# Altium schematic sheet QCopterCAM_MCU_Sch.SchDoc
size A4
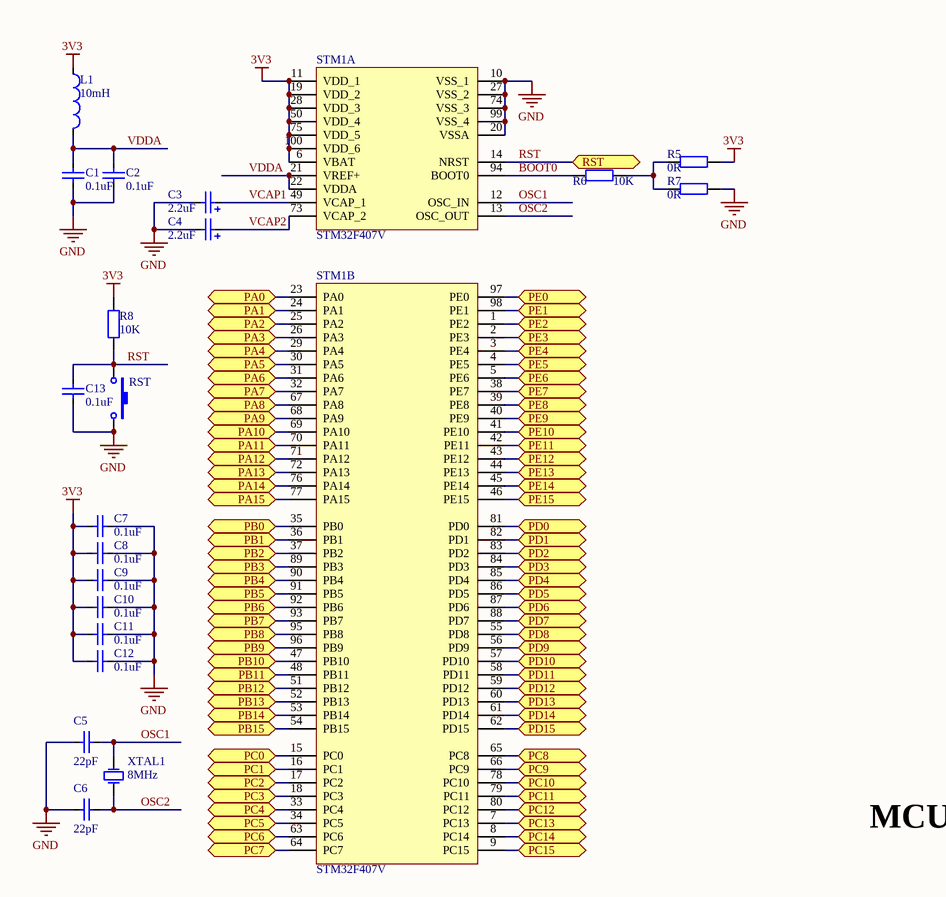
[diagram p0: QCopterCAM_MCU_Sch.SchDoc]

## Parts
C1  value 0.1uF  [CAP_0603]  (hidden comment: Cap_0603)
C2  value 0.1uF  [CAP_0603]  (hidden comment: Cap_0603)
C3  value 2.2uF  [CAP_TAN_P0805]  (hidden comment: Cap_Tan_0805)
C4  value 2.2uF  [CAP_TAN_P0805]  (hidden comment: Cap_Tan_0805)
C5  value 22pF  [CAP_0603]  (hidden comment: Cap_0603)
C6  value 22pF  [CAP_0603]  (hidden comment: Cap_0603)
C7  value 0.1uF  [CAP_0603]  (hidden comment: Cap_0603)
C8  value 0.1uF  [CAP_0603]  (hidden comment: Cap_0603)
C9  value 0.1uF  [CAP_0603]  (hidden comment: Cap_0603)
C10  value 0.1uF  [CAP_0603]  (hidden comment: Cap_0603)
C11  value 0.1uF  [CAP_0603]  (hidden comment: Cap_0603)
C12  value 0.1uF  [CAP_0603]  (hidden comment: Cap_0603)
C13  value 0.1uF  [CAP_0603]  (hidden comment: Cap_0603)
L1  value 10mH  [IND_0603]  (hidden comment: Ind_0603)
R5  value 0R  [RES_0603]  (hidden comment: Res_0603)
R6  value 10K  [RES_0603]  (hidden comment: Res_0603)
R7  value 0R  [RES_0603]  (hidden comment: Res_0603)
R8  value 10K  [RES_0603]  (hidden comment: Res_0603)
RST  SW-PB_1  [BT_90_T]  (value not drawn)
STM1  STM32F407V  [STM32F_100]  (parts A,B of 2)
XTAL1  value 8MHz  [XTAL_5032]  (hidden comment: XTAL_5032)

## Ports
PA0, PA1, PA2, PA3, PA4, PA5, PA6, PA7, PA8, PA9, PA10, PA11, PA12, PA13, PA14, PA15, PB0, PB1, PB2, PB3, PB4, PB5, PB6, PB7, PB8, PB9, PB10, PB11, PB12, PB13, PB14, PB15, PC0, PC1, PC2, PC3, PC4, PC5, PC6, PC7, PC8, PC9, PC10, PC11, PC12, PC13, PC14, PC15, PD0, PD1, PD2, PD3, PD4, PD5, PD6, PD7, PD8, PD9, PD10, PD11, PD12, PD13, PD14, PD15, PE0, PE1, PE2, PE3, PE4, PE5, PE6, PE7, PE8, PE9, PE10, PE11, PE12, PE13, PE14, PE15, RST

## Nets
3V3: C7.2 C8.2 C9.2 C10.2 C11.2 C12.2 L1.1 R5.2 R8.1 STM1.6(VBAT) STM1.11(VDD_1) STM1.19(VDD_2) STM1.28(VDD_3) STM1.50(VDD_4) STM1.75(VDD_5) STM1.100(VDD_6)
GND: C1.2 C2.2 C3.2 C4.2 C5.1 C6.1 C7.1 C8.1 C9.1 C10.1 C11.1 C12.1 C13.2 R7.2 RST.2 STM1.10(VSS_1) STM1.20(VSSA) STM1.27(VSS_2) STM1.74(VSS_3) STM1.99(VSS_4)
BOOT0: R6.1 STM1.94(BOOT0)
OSC1: C5.2 STM1.12(OSC_IN) XTAL1.2(OSC2)
OSC2: C6.2 STM1.13(OSC_OUT) XTAL1.1(OSC1)
PA0: STM1.23(PA0) ; port PA0
PA1: STM1.24(PA1) ; port PA1
PA2: STM1.25(PA2) ; port PA2
PA3: STM1.26(PA3) ; port PA3
PA4: STM1.29(PA4) ; port PA4
PA5: STM1.30(PA5) ; port PA5
PA6: STM1.31(PA6) ; port PA6
PA7: STM1.32(PA7) ; port PA7
PA8: STM1.67(PA8) ; port PA8
PA9: STM1.68(PA9) ; port PA9
PA10: STM1.69(PA10) ; port PA10
PA11: STM1.70(PA11) ; port PA11
PA12: STM1.71(PA12) ; port PA12
PA13: STM1.72(PA13) ; port PA13
PA14: STM1.76(PA14) ; port PA14
PA15: STM1.77(PA15) ; port PA15
PB0: STM1.35(PB0) ; port PB0
PB1: STM1.36(PB1) ; port PB1
PB2: STM1.37(PB2) ; port PB2
PB3: STM1.89(PB3) ; port PB3
PB4: STM1.90(PB4) ; port PB4
PB5: STM1.91(PB5) ; port PB5
PB6: STM1.92(PB6) ; port PB6
PB7: STM1.93(PB7) ; port PB7
PB8: STM1.95(PB8) ; port PB8
PB9: STM1.96(PB9) ; port PB9
PB10: STM1.47(PB10) ; port PB10
PB11: STM1.48(PB11) ; port PB11
PB12: STM1.51(PB12) ; port PB12
PB13: STM1.52(PB13) ; port PB13
PB14: STM1.53(PB14) ; port PB14
PB15: STM1.54(PB15) ; port PB15
PC0: STM1.15(PC0) ; port PC0
PC1: STM1.16(PC1) ; port PC1
PC2: STM1.17(PC2) ; port PC2
PC3: STM1.18(PC3) ; port PC3
PC4: STM1.33(PC4) ; port PC4
PC5: STM1.34(PC5) ; port PC5
PC6: STM1.63(PC6) ; port PC6
PC7: STM1.64(PC7) ; port PC7
PC8: STM1.65(PC8) ; port PC8
PC9: STM1.66(PC9) ; port PC9
PC10: STM1.78(PC10) ; port PC10
PC11: STM1.79(PC11) ; port PC11
PC12: STM1.80(PC12) ; port PC12
PC13: STM1.7(PC13) ; port PC13
PC14: STM1.8(PC14) ; port PC14
PC15: STM1.9(PC15) ; port PC15
PD0: STM1.81(PD0) ; port PD0
PD1: STM1.82(PD1) ; port PD1
PD2: STM1.83(PD2) ; port PD2
PD3: STM1.84(PD3) ; port PD3
PD4: STM1.85(PD4) ; port PD4
PD5: STM1.86(PD5) ; port PD5
PD6: STM1.87(PD6) ; port PD6
PD7: STM1.88(PD7) ; port PD7
PD8: STM1.55(PD8) ; port PD8
PD9: STM1.56(PD9) ; port PD9
PD10: STM1.57(PD10) ; port PD10
PD11: STM1.58(PD11) ; port PD11
PD12: STM1.59(PD12) ; port PD12
PD13: STM1.60(PD13) ; port PD13
PD14: STM1.61(PD14) ; port PD14
PD15: STM1.62(PD15) ; port PD15
PE0: STM1.97(PE0) ; port PE0
PE1: STM1.98(PE1) ; port PE1
PE2: STM1.1(PE2) ; port PE2
PE3: STM1.2(PE3) ; port PE3
PE4: STM1.3(PE4) ; port PE4
PE5: STM1.4(PE5) ; port PE5
PE6: STM1.5(PE6) ; port PE6
PE7: STM1.38(PE7) ; port PE7
PE8: STM1.39(PE8) ; port PE8
PE9: STM1.40(PE9) ; port PE9
PE10: STM1.41(PE10) ; port PE10
PE11: STM1.42(PE11) ; port PE11
PE12: STM1.43(PE12) ; port PE12
PE13: STM1.44(PE13) ; port PE13
PE14: STM1.45(PE14) ; port PE14
PE15: STM1.46(PE15) ; port PE15
RST: C13.1 R8.2 RST.1 STM1.14(NRST) ; port RST
VCAP1: C3.1 STM1.49(VCAP_1)
VCAP2: C4.1 STM1.73(VCAP_2)
VDDA: C1.1 C2.1 L1.2 STM1.21(VREF+) STM1.22(VDDA)
NetR5_1: R5.1 R6.2 R7.1

## Notes on the sheet
- MCU

## Library data of the parts
C1 C2 C5-C13 = Cap_0603: Capacitor
C3 C4 = Cap_Tan_0805: Capacitor
L1 = Ind_0603: Inductor
R5-R8 = Res_0603: Resistor
RST = SW-PB_1: Switch; Published: 24-Mar-1999; LatestRevisionDate: 17-Jul-2002; LatestRevisionNote: Re-released for DXP Platform.; PackageReference: SPST-2; Publisher: Altium Limited; PackageDescription: Switch; 2 Leads
STM1 = STM32F407V: MCU
XTAL1 = XTAL_5032: Crystal Oscillator; Published: 8-Jun-2000; LatestRevisionDate: 17-Jul-2002; LatestRevisionNote: Re-released for DXP Platform.; PackageReference: R38; Publisher: Altium Limited; PackageDescription: Crystal, Thru-Hole; 2 Leads; Body 3.1 x 8.2 mm (Dia.xH)